# Altium project PCB_Project.PrjPcb
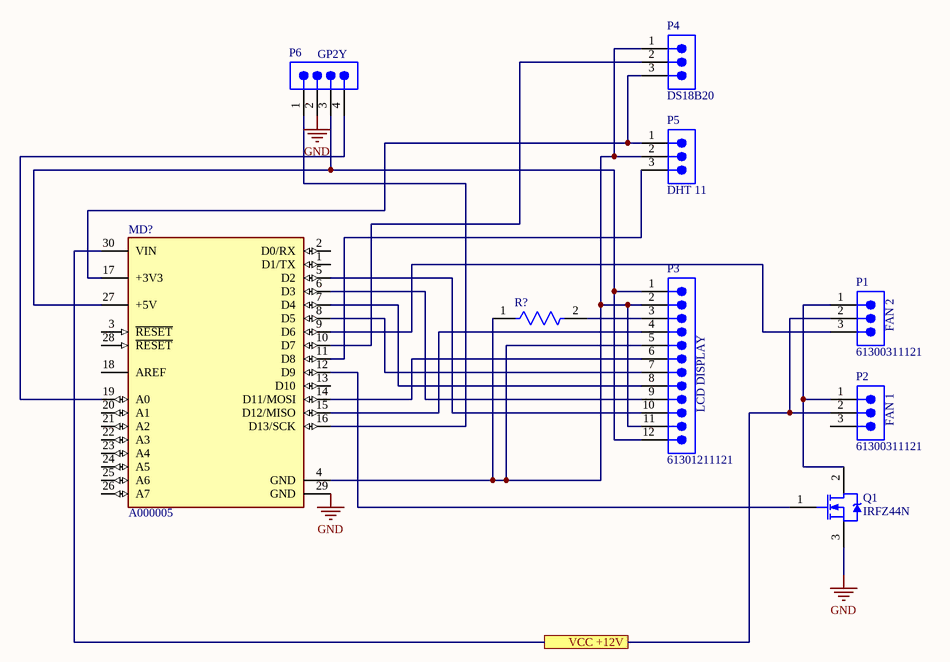
[diagram p0: Sheet1.SchDoc]
1 sheet, 9 parts. Net scope: flat (ports and power ports of the same name join across sheets).
Board file: PCB1.PcbDoc

## Sheet Sheet1.SchDoc
size A4; SheetNumber: 1; SheetTotal: 1

### Parts
1K  CCF5526K7FKE36  [FP-CCF55-MFG]  (value not drawn)
MD?  A000005  [FP-A000005-MFG]
P1  61300311121  [61300311121]
P2  61300311121  [61300311121]
P3  61301211121  [61301211121]
P4  DS18B20  [61300311121]
P5  DHT 11  [61300311121]
P6  GP2Y  [61300411121]
Q1  IRFZ44N  [INF-PG-TO220-3-1]

### Ports
VCC +12V

### Nets
GND: MD?.29(GND) P6.2 Q1.3(SOURCE)
Net1K_1: 1K.1 MD?.4(GND) P3.2 P3.5 P3.11 P4.1 P5.2
Net1K_2: 1K.2 P3.3
NetMD?_5: MD?.5(D2) P3.10
NetMD?_6: MD?.6(D3) P3.9
NetMD?_7: MD?.7(D4) P3.8
NetMD?_8: MD?.8(D5) P3.7
NetMD?_9: MD?.9(D6) P1.3
NetMD?_10: MD?.10(D7) P4.2
NetMD?_11: MD?.11(D8) P5.3
NetMD?_12: MD?.12(D9) Q1.1(GATE)
NetMD?_14: MD?.14(D11/MOSI) P3.6
NetMD?_15: MD?.15(D12/MISO) P3.4
NetMD?_16: MD?.16(D13/SCK) P6.1
NetMD?_17: MD?.17(+3V3) P4.3 P5.1
NetMD?_19: MD?.19(A0) P6.4
NetMD?_27: MD?.27(+5V) P3.1 P3.12 P6.3
NetMD?_30: MD?.30(VIN) P1.2 P2.2 ; port VCC +12V
NetP1_1: P1.1 P2.1 Q1.2(DRAIN)

Not connected (* = marked no-connect by the designer): MD? 1(D1/TX) 2(D0/RX) 3(~{RESET}) 13(D10) 18(AREF) 20(A1) 21(A2) 22(A3) 23(A4) 24(A5) 25(A6) 26(A7) 28(~{RESET}); P2 3

### Notes on the sheet
- (near P1) FAN 2
- (near P3) LCD DISPLAY
- (near P2) FAN 1

### Library data of the parts
1K = CMP-00030-42465748-1: CCF5526K7FKE36 Res Metal Film 26.7K Ohm 1% 1/4W 1/2W ±100ppm/°C Conformal AXL Thru-Hole T/R; Voltage Rating: 250V; Lead Diameter: 640µm; Power Rating: 500mW; Resistance: 26.7kΩ
MD? = CMP-189986-000002-1: ARDUINO NANO ATMEGA328 EVAL BRD; Number of Bits: 8; Evaluation Kit: Yes; Operating Supply Voltage: 12V; Interface: I2C; Data Bus Width: 8b; Core Architecture: AVR; Packaging: Bulk; Length: 7inch; Package Quantity: 50; Width: 5inch; REACH SVHC: No SVHC; Weight: 0.358383oz; Series: AVR® ATmega; Height: 0.25inch
P1 P2 P4 P5 = CMP-1502-01062-2: NexarPartId: 32855521; Voltage Rating: 250V; Current Rating: 3A; Connector Type: Male Pin; Number of Positions: 3; Gender: Male; Contact Resistance: 20mΩ; Pitch: 2.54mm; Max Operating Temperature: 105°C; Lead Pitch: 2.54mm; Lead Free: Lead Free; Contact Mating Length: 5.9944mm; Contact Material: Copper; Number of Pins: 3; Orientation: Vertical; Height: 8.94mm; Packaging: Bulk; Min Operating Temperature: -40°C; Mount: Through Hole; RoHS: Compliant; Number of Contacts: 3; Operating Supply Voltage: 250V; Termination: Solder; Number of Rows: 1; Contact Plating: Gold; Color: Black; REACH SVHC: Unknown
P3 = CMP-1502-01086-2: NexarPartId: 32855538; Gender: Male; Pitch: 2.54mm; Contact Resistance: 20mΩ; Number of Positions: 12; Current Rating: 3A; Connector Type: Male Pin; Operating Supply Voltage: 250V; Contact Material: Copper; Contact Plating: Gold; Color: Black; REACH SVHC: Unknown; Termination: Solder; Number of Contacts: 12; RoHS: Compliant; Lead Pitch: 2.54mm; Orientation: Vertical; Contact Mating Length: 5.9944mm; Mount: Through Hole; Number of Pins: 12; Packaging: Bulk; Number of Rows: 1
P6 = CMP-1502-01064-2: NexarPartId: 32855522; Pitch: 2.54mm; Number of Contacts: 4; Contact Resistance: 20mΩ; Gender: Male; Current Rating: 3A; Connector Type: Male Pin; Voltage Rating: 250V; Lead Free: Lead Free; Contact Plating: Gold; Max Operating Temperature: 105°C; Packaging: Bulk; Height: 8.89mm; Orientation: Vertical; Contact Mating Length: 5.9944mm; Contact Material: Copper; Lead Pitch: 2.54mm; Min Operating Temperature: -40°C; Termination: Solder; Color: Black; Number of Rows: 1; REACH SVHC: Unknown; RoHS: Compliant; Mount: Through Hole; Number of Positions: 4; Number of Pins: 4; Operating Supply Voltage: 250V
Q1 = CMP-1164-00044-1: N-Channel CoolMOS Power-Transistor, 600 V VDS, 4.5 A ID, -55 to 150 degC, PG-TO220-3-1, Tube, Green; PartNumber: SPP04N60C3; Manufacturer: Infineon; VGS(th) (min): 2.1Â V; VDS (max): 600Â V; RDS (on) (max): 950Â mOhm; RthJA (max): 62Â K/W; Rth: 2.5Â K/W; Polarity: N; Ptot (max): 50Â W; ID (max): 4.5Â A; IDpuls (max): 13.5Â A; VGS(th) (max): 3.9Â V; Green: TRUE; QG: 19Â nC; DatasheetVersion: Rev. 3.1; ComponentLink2URL: http://www.infineon.com/dgdl/SPP_A04N60C3_Rev.3.1.pdf?folderId=db3a304412b407950112b408e8c90004&fileId=db3a304412b407950112b42dd6a14900; ComponentLink3Description: Package Specification; PackageVersion: Jul-12; PackageReference: PG-TO220-3-1; PackageDescription: 3-Pin Plastic (Green) Transistor Single Outline Package, 10 x 9.25 mm Body, 2.54 mm Pitch; ComponentLink3URL: http://www.infineon.com/dgdl/BTS117_DS_14.pdf?folderId=db3a30431400ef68011421b54e2e0564&fileId=db3a30433a747525013abff8302d549c&location=en.Products.Automotive_ICs.Smart_High-_and_Low-Side_Switches.HITFET___TEMPFET__-_Smart_Low-Side_Switches.DATASHEET.BTS1; Packing: Tube; Technology: CoolMOS C3; RthJC (max): 2.5Â K/W; ComponentLink2Description: Datasheet; ComponentLink1URL: http://www.infineon.com/; Mounting Technology: Through Hole; ComponentLink1Description: Manufacturer URL